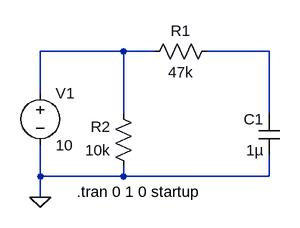
[diagram p0: schematic RC.asc]
RC.asc, the LTspice schematic file:
Version 4
SHEET 1 880 680
WIRE 224 80 96 80
WIRE 272 80 224 80
WIRE 448 80 352 80
WIRE 96 144 96 80
WIRE 224 176 224 80
WIRE 448 176 448 80
WIRE 96 272 96 224
WIRE 224 272 224 256
WIRE 224 272 96 272
WIRE 448 272 448 240
WIRE 448 272 224 272
WIRE 96 304 96 272
FLAG 96 304 0
SYMBOL res 368 64 R90
WINDOW 0 0 56 VBottom 2
WINDOW 3 32 56 VTop 2
SYMATTR InstName R1
SYMATTR Value 47k
SYMBOL res 240 272 R180
WINDOW 0 36 76 Left 2
WINDOW 3 36 40 Left 2
SYMATTR InstName R2
SYMATTR Value 10k
SYMBOL cap 464 240 R180
WINDOW 0 24 56 Left 2
WINDOW 3 24 8 Left 2
SYMATTR InstName C1
SYMATTR Value 1µ
SYMBOL voltage 96 128 R0
SYMATTR InstName V1
SYMATTR Value 10
TEXT 152 296 Left 2 !.tran 0 1 0 startup

The netlist it stands for:
* RC.asc
R1 N002 N001 47k
R2 0 N001 10k
C1 0 N002 1µ
V1 N001 0 10
.tran 0 1 0 startup
.backanno
.end